# EAGLE design EcobitNRF9160 EV2 (EAGLE 9.2.2)
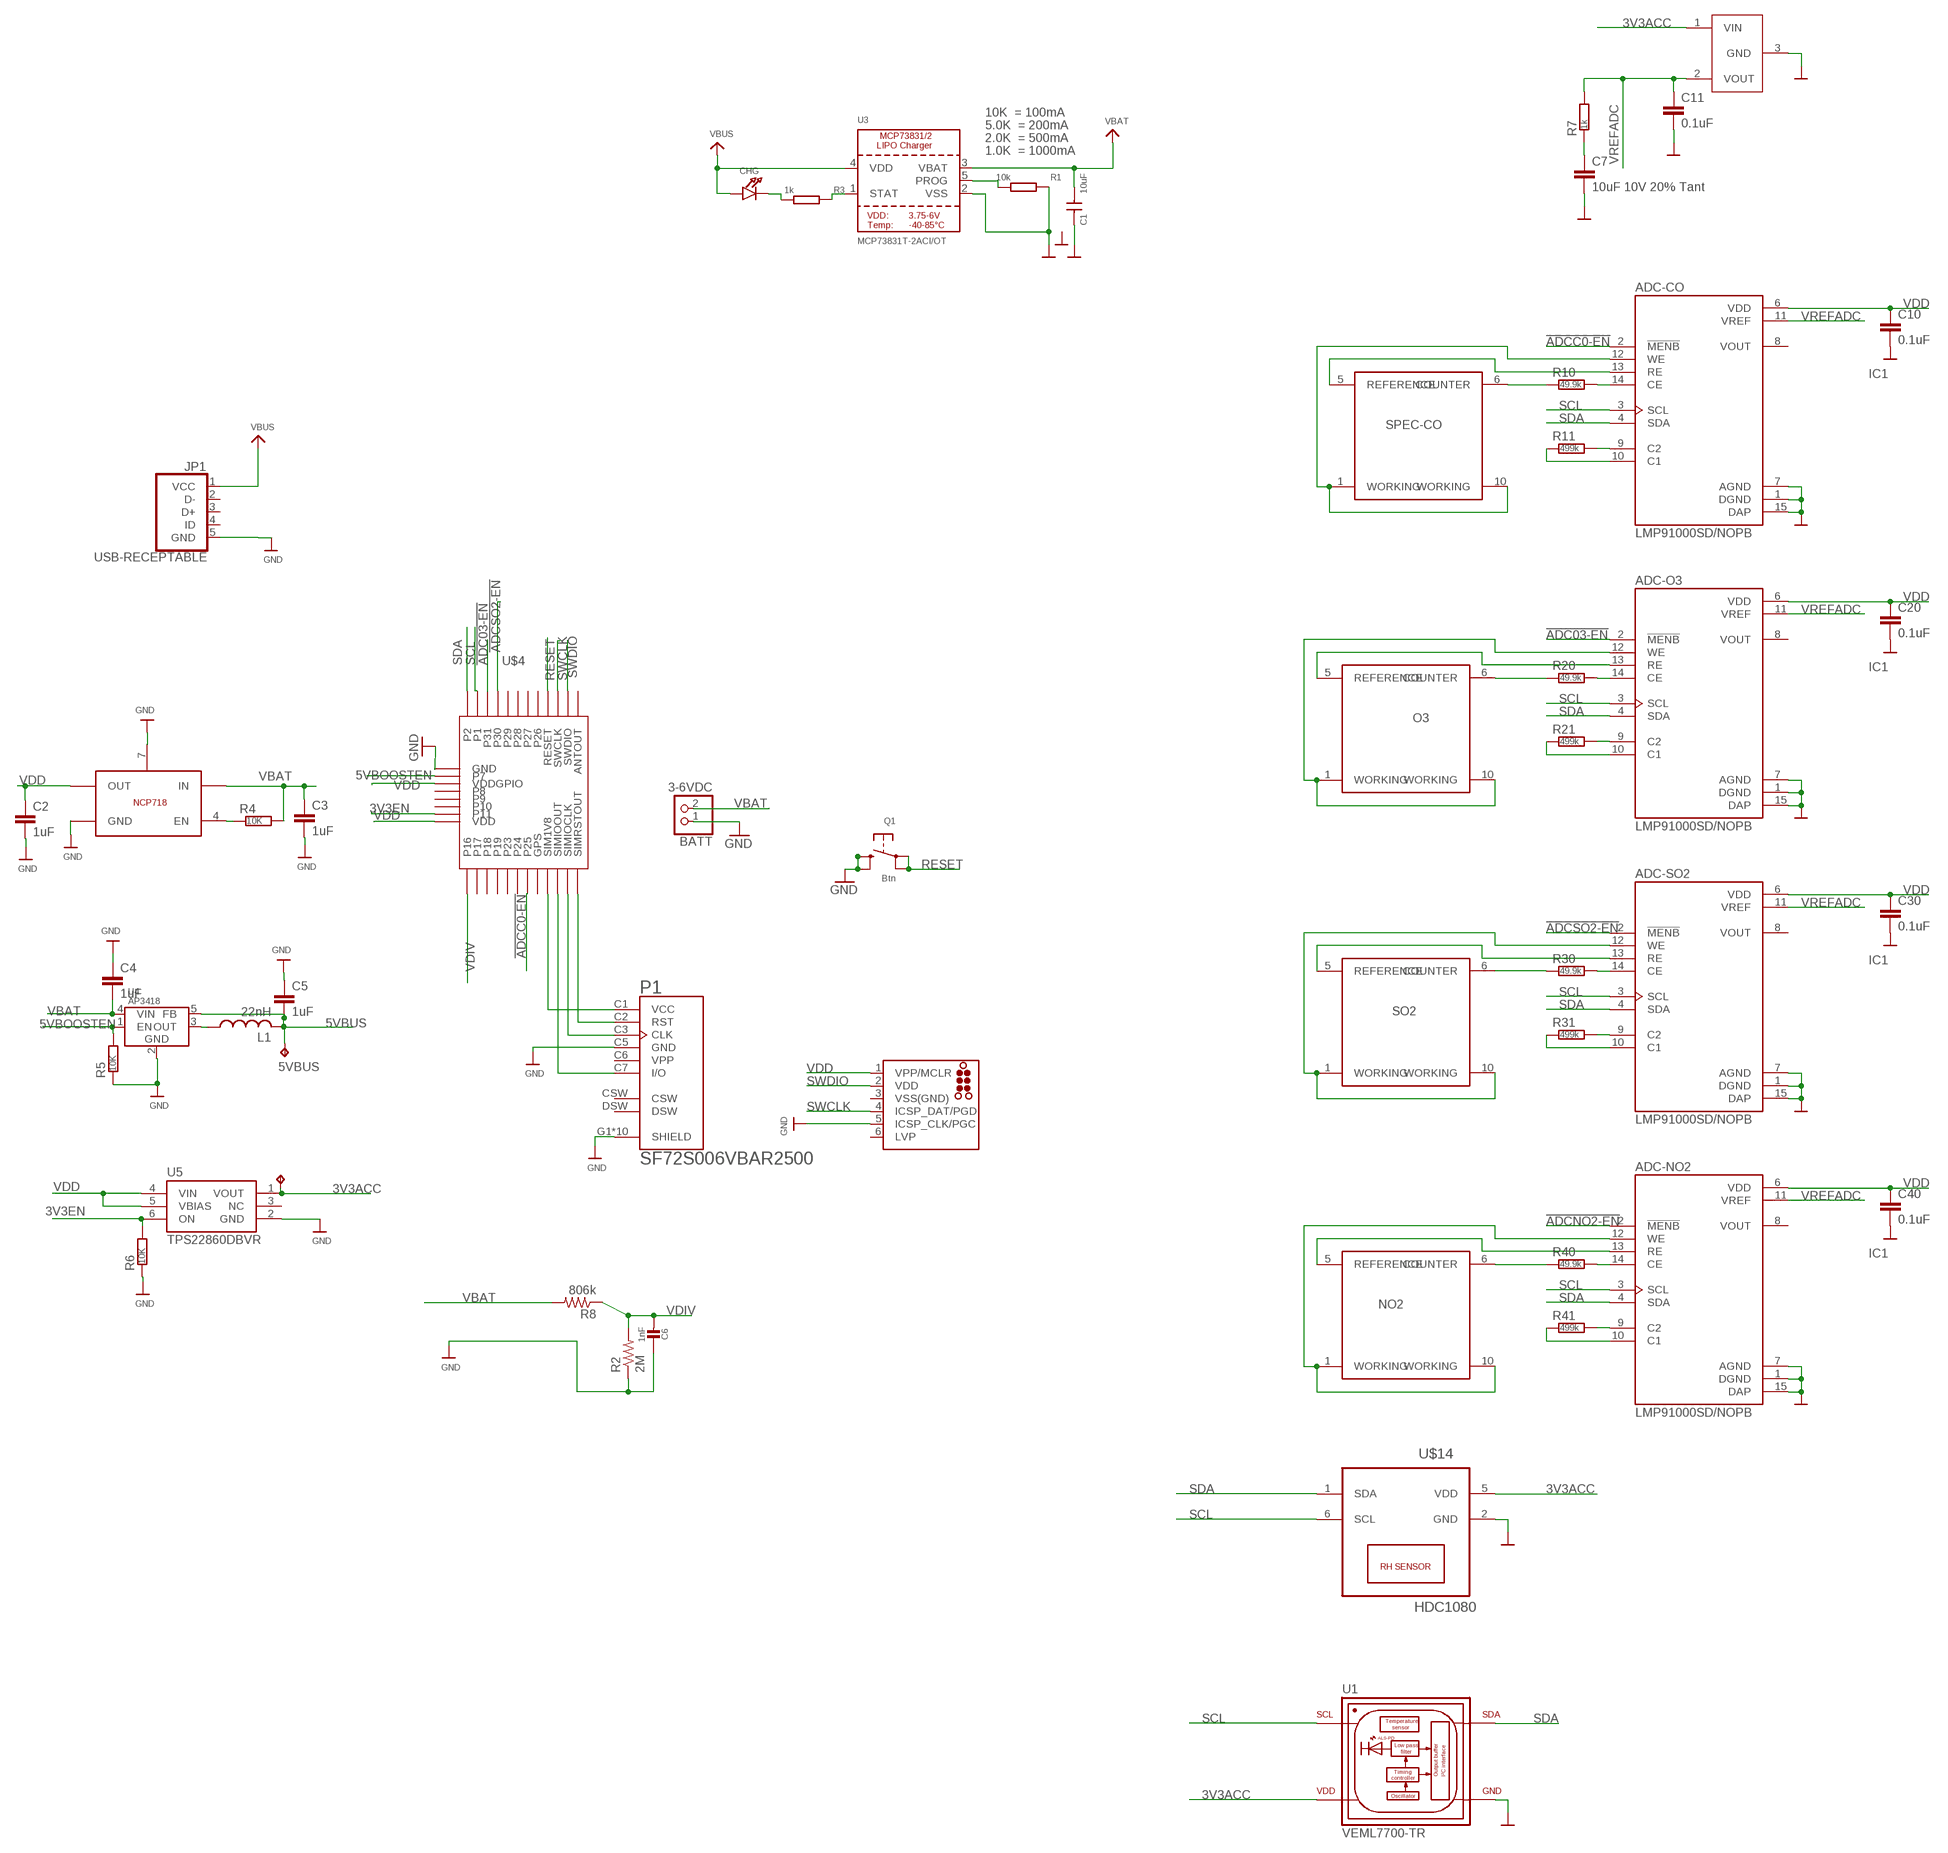
[diagram p0: schematic, sheet 1]

## Parts
5VBUS  TPTP15R  [TP15R]
5VBUS1  TPTP15R  [TP15R]
ADC-CO  LMP91000SD/NOPB  [SON50P400X400X80-15N]
ADC-NO2  LMP91000SD/NOPB  [SON50P400X400X80-15N]
ADC-O3  LMP91000SD/NOPB  [SON50P400X400X80-15N]
ADC-SO2  LMP91000SD/NOPB  [SON50P400X400X80-15N]
BATT  3-6VDC  CON_JST_PH_2PIN  [JSTPH2]
C1  10uF  CAP0402  [C-0402]
C2  1uF  CAPACITOR_0402_N  [RESC0402_N]
C3  1uF  CAPACITOR_0402_N  [RESC0402_N]
C4  1uF  CAPACITOR_0402_N  [RESC0402_N]
C5  1uF  CAPACITOR_0402_N  [RESC0402_N]
C6  1nF  CAP_CERAMIC0603_NO  [0603-NO]
C7  10uF 10V 20% Tant  CAPACITOR_0805_N  [RESC0805_N]
C10  0.1uF  CAPACITOR_0603_N  [RESC0603_N]
C11  0.1uF  CAPACITOR_0603_N  [RESC0603_N]
C20  0.1uF  CAPACITOR_0603_N  [RESC0603_N]
C30  0.1uF  CAPACITOR_0603_N  [RESC0603_N]
C40  0.1uF  CAPACITOR_0603_N  [RESC0603_N]
CHG  LED0805_NOOUTLINE  [CHIPLED_0805_NOOUTLINE]
IC1  ISL60002DIH320Z-TK  [SOT-23-3]
J2  TC2030-MCP-NL  [TC2030-MCP-NL]
JP1  USB-RECEPTABLE  [FCI-10103594-0001LF]
L1  22nH  INDUCTOR_0603_N  [RESC0603_N]
NO2  SPECSENSOR  [SPECSENSOR]
O3  SPECSENSOR  [SPECSENSOR]
P1  SF72S006VBAR2500  [JAE_SF72S006VBAR2500]
Q1  Btn  SWITCH_TACT_SMT4.6X2.8  [BTN_KMR2_4.6X2.8]
R1  10k  RESR0402  [R0402]
R2  2M  R-US_R0603  [R0603]
R3  1k  RESR0402  [R0402]
R4  10K  RESISTOR_0402_N  [RESC0402_N]
R5  10K  RESISTOR_0402_N  [RESC0402_N]
R6  10K  RESISTOR_0402_N  [RESC0402_N]
R7  1k  RESISTOR_0603_N  [RESC0603_N]
R8  806k  R-US_R0603  [R0603]
R10  49.9k  RESISTOR_0603_N  [RESC0603_N]
R11  499k  RESISTOR_0603_N  [RESC0603_N]
R20  49.9k  RESISTOR_0603_N  [RESC0603_N]
R21  499k  RESISTOR_0603_N  [RESC0603_N]
R30  49.9k  RESISTOR_0603_N  [RESC0603_N]
R31  499k  RESISTOR_0603_N  [RESC0603_N]
R40  49.9k  RESISTOR_0603_N  [RESC0603_N]
R41  499k  RESISTOR_0603_N  [RESC0603_N]
SO2  SPECSENSOR  [SPECSENSOR]
SPEC-CO  SPECSENSOR  [SPECSENSOR]
U1  VEML7700-TR  [XDCR_VEML7700-TR]
U2  NCP718  [NCP718-WDFN6]
U3  MCP73831T-2ACI/OT  MCP73831/2  [SOT23-5]
U4  AP3418  [SOT25]
U5  TPS22860DBVR  [R-PDSO-G6]
U$4  NRF9160MODULE  [NRF9160MODULE]
U$14  HDC1080  [TI-S-PWSON-N6]

## Nets
3V3ACC: 5VBUS1.TP IC1.1(VIN) U1.2(VDD) U5.1(VOUT) U$14.5(VDD)
3V3EN: R6.2 U5.6(ON) U$4.P11
5VBOOSTEN: R5.2 U4.1(EN) U$4.P7
5VBUS: 5VBUS.TP C5.2 L1.2 U4.5(FB)
!ADC03-EN: ADC-O3.2(!MENB) U$4.P31
!ADCC0-EN: ADC-CO.2(!MENB) U$4.P25
!ADCNO2-EN: ADC-NO2.2(!MENB)
!ADCSO2-EN: ADC-SO2.2(!MENB) U$4.P30
GND: ADC-CO.1(DGND) ADC-CO.7(AGND) ADC-CO.15(DAP) ADC-NO2.1(DGND) ADC-NO2.7(AGND) ADC-NO2.15(DAP) ADC-O3.1(DGND) ADC-O3.7(AGND) ADC-O3.15(DAP) ADC-SO2.1(DGND) ADC-SO2.7(AGND) ADC-SO2.15(DAP) BATT.1 C1.2 C2.2 C3.2 C4.1 C5.1 C6.1 C7.2 C10.2 C11.2 C20.2 C30.2 C40.2 IC1.3(GND) J2.5(ICSP_CLK/PGC) JP1.5(GND) P1.C5(GND) P1.G1(SHIELD) P1.G2(SHIELD) P1.G3(SHIELD) P1.G4(SHIELD) P1.G5(SHIELD) P1.G6(SHIELD) P1.G7(SHIELD) P1.G8(SHIELD) P1.G9(SHIELD) P1.G10(SHIELD) Q1.B'(S1) Q1.B(S) R1.1 R2.1 R5.1 R6.1 U1.3(GND) U2.3(GND) U2.7(GND) U3.2(VSS) U4.2(GND) U5.2(GND) U$4.GND U$14.2(GND)
N$1: P1.C1(VCC) U$4.SIM1V8
N$2: L1.1 U4.3(OUT)
N$3: R3.1 U3.1(STAT)
N$4: CHG.C R3.2
N$5: P1.C2(RST) U$4.SIMRSTOUT
N$6: P1.C3(CLK) U$4.SIMCLKOUT(SIMIOCLK)
N$7: P1.C7(I/O) U$4.SIMIOOUT
N$8: ADC-CO.9(C2) R11.2
N$9: ADC-CO.10(C1) R11.1
N$10: R1.2 U3.5(PROG)
N$11: ADC-CO.14(CE) R10.2
N$12: C7.1 R7.1
N$13: ADC-O3.9(C2) R21.2
N$14: ADC-O3.10(C1) R21.1
N$15: ADC-O3.14(CE) R20.2
N$16: ADC-SO2.9(C2) R31.2
N$17: ADC-SO2.10(C1) R31.1
N$18: ADC-SO2.14(CE) R30.2
N$19: ADC-NO2.9(C2) R41.2
N$20: ADC-NO2.10(C1) R41.1
N$21: ADC-NO2.14(CE) R40.2
R-EN: R4.1 U2.4(EN)
RESET: Q1.A'(P1) Q1.A(P) U$4.RESET
SCL: ADC-CO.3(SCL) ADC-NO2.3(SCL) ADC-O3.3(SCL) ADC-SO2.3(SCL) U1.1(SCL) U$4.P1 U$14.6(SCL)
SDA: ADC-CO.4(SDA) ADC-NO2.4(SDA) ADC-O3.4(SDA) ADC-SO2.4(SDA) U1.4(SDA) U$4.P2 U$14.1(SDA)
SPEC-CO-COUNTER: R10.1 SPEC-CO.6(COUNTER)
SPEC-CO-REF: ADC-CO.13(RE) SPEC-CO.5(REFERENCE)
SPEC-CO-WKG: ADC-CO.12(WE) SPEC-CO.1(WORKING) SPEC-CO.10(WORKING)
SPEC-NO2-COUNTER: NO2.6(COUNTER) R40.1
SPEC-NO2-REF: ADC-NO2.13(RE) NO2.5(REFERENCE)
SPEC-NO2-WKG: ADC-NO2.12(WE) NO2.1(WORKING) NO2.10(WORKING)
SPEC-O3-COUNTER: O3.6(COUNTER) R20.1
SPEC-O3-REF: ADC-O3.13(RE) O3.5(REFERENCE)
SPEC-O3-WKG: ADC-O3.12(WE) O3.1(WORKING) O3.10(WORKING)
SPEC-SO2-COUNTER: R30.1 SO2.6(COUNTER)
SPEC-SO2-REF: ADC-SO2.13(RE) SO2.5(REFERENCE)
SPEC-SO2-WKG: ADC-SO2.12(WE) SO2.1(WORKING) SO2.10(WORKING)
SWCLK: J2.4(ICSP_DAT/PGD) U$4.SWCLK
SWDIO: J2.2(VDD) U$4.SWDIO
VBAT: BATT.2 C1.1 C3.1 C4.2 R4.2 R8.2 U2.6(IN) U3.3(VBAT) U4.4(VIN)
VBUS: CHG.A JP1.1(VCC) U3.4(VDD)
VDD: ADC-CO.6(VDD) ADC-NO2.6(VDD) ADC-O3.6(VDD) ADC-SO2.6(VDD) C2.1 C10.1 C20.1 C30.1 C40.1 J2.1(VPP/MCLR) U2.1(OUT) U5.4(VIN) U5.5(VBIAS) U$4.VDD U$4.VDDGPIO
VDIV: C6.2 R2.2 R8.1 U$4.P16
VREFADC: ADC-CO.11(VREF) ADC-NO2.11(VREF) ADC-O3.11(VREF) ADC-SO2.11(VREF) C11.1 IC1.2(VOUT) R7.2
Unconnected: ADC-CO.8(VOUT) ADC-NO2.8(VOUT) ADC-O3.8(VOUT) ADC-SO2.8(VOUT) J2.6(LVP) JP1.2(D-) JP1.3(D+) JP1.4(ID) P1.CSW P1.DSW U5.3(NC) U$4.ANTOUT U$4.GPS U$4.P8 U$4.P9 U$4.P10 U$4.P17 U$4.P18 U$4.P19 U$4.P23 U$4.P24 U$4.P26 U$4.P27 U$4.P28 U$4.P29

## Notes on the sheet
- 10K  = 100mA
- 5.0K  = 200mA
- 2.0K  = 500mA
- 1.0K  = 1000mA

## Power pins joined to a net without a drawn wire
VPP: P1.C6(VPP)
VSS(GND): J2.3(VSS(GND))

## Library data of the parts
5VBUS 5VBUS1 = testpad:TP: Test pad
ADC-CO ADC-NO2 ADC-O3 ADC-SO2 = LMP91000SD_NOPB:LMP91000SD/NOPB: Configurable AFE Potentiostat for Low-Power Chemical Sensing Applications 14-WSON -40 to 85; AVAILABILITY: Unavailable; DESCRIPTION: Configurable AFE Potentiostat for Low-Power Chemical Sensing Applications 14-WSON -40 to 85; MF: Texas Instruments; MP: LMP91000SD/NOPB; PACKAGE: WFDFN-14 Texas Instruments; PRICE: None
BATT = microbuilder:CON_JST_PH_2PIN: JST 2-Pin Right-Angle Connector PH-Series - 4UConnector: 17311 SH-Series - 4UConnector: 07278
C1 = NANO2:CAP: CAP
C2-C5 C7 C10 C11 C20 C30 C40 = NordicMisc:CAPACITOR: Generic chip capacitor
C6 = microbuilder:CAP_CERAMIC: Ceramic Capacitors For new designs, use the packages preceded by an '_' character since they are more reliable: The following footprints should be used on most boards: _0402 - Standard footprint for regular board layouts _0603 - Standard footprint for regular board layouts _0805 - Standard footprint for regular board layouts _1206 - Standard footprint for regular board layouts For extremely tight-pitch boards where space is at a premium, the following 'micro-pitch' footprints can be used (smaller pads, no silkscreen outline, etc.): _0402MP - Micro-pitch footprint for very dense/compact boards _0603MP - Micro-pitch footprint for very dense/compact boards _0805MP - Micro-pitch footprint for very dense/compact boards _1206MP - Micro-pitch footprint for very dense/compact boards
CHG = microbuilder:LED: LED 0603 - 0603 Surface Mount Package 2mA: Green LED - Low Power (3.9mcd, 2ma, 1.7Vf) - Digikey: 475-2709-2-ND Orange LED - Low Power (9.8mcd, 2ma, 1.8Vf) - Digikey: 475-1194-2-ND Red LED - Low Power (5mcd, 2ma, 1.8Vf) - Digikey: 475-1195-2-ND Yellow LED - Low Power (7mcd, 2ma, 1.8Vf) - Digikey: 475-1196-2-ND 5mA: Blue LED - Low Power (17mcd, 5ma, 2.9Vf) - Digikey: LNJ937W8CRACT-ND 0805 - 0805 Surface Mount Package 2mA: Red LED (8.8mcd, 2mA, 1.8Vf, Clear) - Low Power [Digikey: 475-2510-1-ND] Green LED (5mcd, 2mA, 1.8Vf, Clear) - Low Power [Digikey: 475-2730-1-ND] Yellow LED (11.3mcd, 2mA, 1.8Vf, Clear) - Low Power [Digikey: 475-2555-1-ND] 20mA: Red LED (104mcd, 20mA, Diffused) - LS R976 [Digikey: 475-1278-6-ND] Red LED (12mcd, 20mA, 2.0Vf, Clear) - APT2012EC [Digikey: 754-1128-1-ND] Green LED (15mcd, 20mA, 2.2Vf, Clear) - APT2012GC [Digikey: 754-1131-1-ND] Orange LED (160mcd, 20mA, 2.1Vf, Clear) - APT2012SECK [Digikey: 754-1130-1-ND] 1206 - 1206 Surface Mount Package Green LED (26mcd, 20mA, Diffused) - LG N971 [Digikey: 475-1407-6-ND] Red LED (15mcd, 20mA, Diffused) - LH N974 [Digikey: 475-1416-6-ND] Cree - Cree High-Power Surface Mount LEDs XPEBWT-L1-0000-00D50 - White 111lm 350mA 2.9Vf 6200K 110° XTEAWT-00-0000-00000LEE3 - White 114lm 350mA 2.85Vf 5000K 115° Everlight - Everlight 45-21 Series Surface Mount LEDs 45-21/QK2C-B2832AC2CB2/2T - Warm White 2000mcd 20mA 3.25Vf 3050K 120° 45-21/LK2C-B38452C4CB2/2T - Nuetral White 2000mcd 20mA 3.25Vf 4150K 120° 45-21/LK2C-B50634C6CB2/2T - Cold White 2200mcd 20mA 3.25Vf 5650K 120° PLCC2 Reverse Mount LS T77K-J1L2-1-0-2-R18-Z - Red 11.25mcd 2mA 1.8Vf 630nm 120° LO T77K-L1M2-24-Z - Orange 19.6mcd 2mA 1.8Vf 606nm 120° LY T77K-K2M1-26-Z - Yellow 15.7mcd 2mA 1.8Vf 587nm 120°
IC1 = ISL60002DIH320Z-TK:ISL60002DIH320Z-TK
J2 = tag-connect:TC2030: TAG-CONNECT ICSP Connector Manufacturer: Tag-Connect <http://www.tag-connect.com> Cable for easy In-Circuit Serial Programming. Designed for Microchip ICD2, suitable for many others. Two variants - one "with legs" (for hands-free fit on PCB) and another "without legs" for quick programming. PAD Description 1 MCLR/Vpp 2 Vdd 3 GND 4 PGD (ISPDAT) 5 PGC (ISPCLK) 6 nc (used for LVP) ©2009 ROFA.cz - modified and updated by Robert Darlington ‹rdarlington@gmail.com›
JP1 = daspilker MICROUSB:USB-RECEPTABLE: USB Receptable
L1 = NordicMisc:INDUCTOR: Generic chip inductor
NO2 O3 SO2 SPEC-CO = SiliconSquared:SPECSENSOR
P1 = SF72S006VBAR2500:SF72S006VBAR2500: SF72 series, nano-SIM card connector, normail open type, 6 connector; AVAILABILITY: Unavailable; DESCRIPTION: SF72 series, nano-SIM card connector, normail open type, 6 connector; MF: JAE Electronics; MP: SF72S006VBAR2500; PACKAGE: None; PRICE: None
Q1 = microbuilder:SWITCH_TACT_SMT: SMT Tact Switches 6x6mm - Digikey: P12940SCT-ND KMR2 (4.6x2.8mm) - Digikey: 401-1426-1-ND EVQ-PQHB55 - Light Touch, 160GF (4.5x4.5mm) - Digikey: P8090SCT-ND KMT0 - KMT021 NGJ LHS (etc.) IP68/Waterproof - Digikey: CKN10289CT-ND
R1 R3 = 1RedBeard:RES: RES
R2 R8 = resistor:R-US_: RESISTOR, American symbol
R4-R7 R10 R11 R20 R21 R30 R31 R40 R41 = NordicMisc:RESISTOR: Generic chip resistor
U1 = VEML7700-TR:VEML7700-TR: Light to Digital Ambient Light Sensor Digital 0lux to 167000lux 8-Pin SMD T/R; DESCRIPTION: Light to Digital Ambient Light Sensor Digital 0lux to 167000lux 8-Pin SMD T/R; DIGI-KEY_PART_NUMBER: VEML7700CT-ND; DIGI-KEY_PURCHASE_URL: https://www.digikey.com/product-detail/en/vishay-semiconductor-opto-division/VEML7700-TR/VEML7700CT-ND/5820244?utm_source=snapeda&utm_medium=aggregator&utm_campaign=symbol; MF: Vishay; MP: VEML7700-TR; PACKAGE: SMD-4 Vishay
U2 = NCP718 Low Dropout Regulator:NCP718
U3 = microbuilder:MCP73831/2: MCP73831/2 LIPO Charger VDD: 3.75 - 6V Temp -40 - 85°C Programmable Charge Rate: 15-500mA NOTE: STAT is a tri-state logic output on the MCP73831 and an open-drain output on the MCP73832. SOT23-5 with 4.2V output and tri-state logic on STAT = MCP73831T-2ACI/OT
U4 = AP3418 3v3 to 5V DCDC Booster:AP3418
U5 = TexasCustom:TPS22860DBVR: Power Switch ICs - Power Distribution TPS22860 Ultra-low leakage load switch 6-SOT-23 -40 to 85
U$4 = switch-ck:NRF9160MODULE
U$14 = Texas HDC1080 Humidity-Temp sensor:HDC1080

## Board
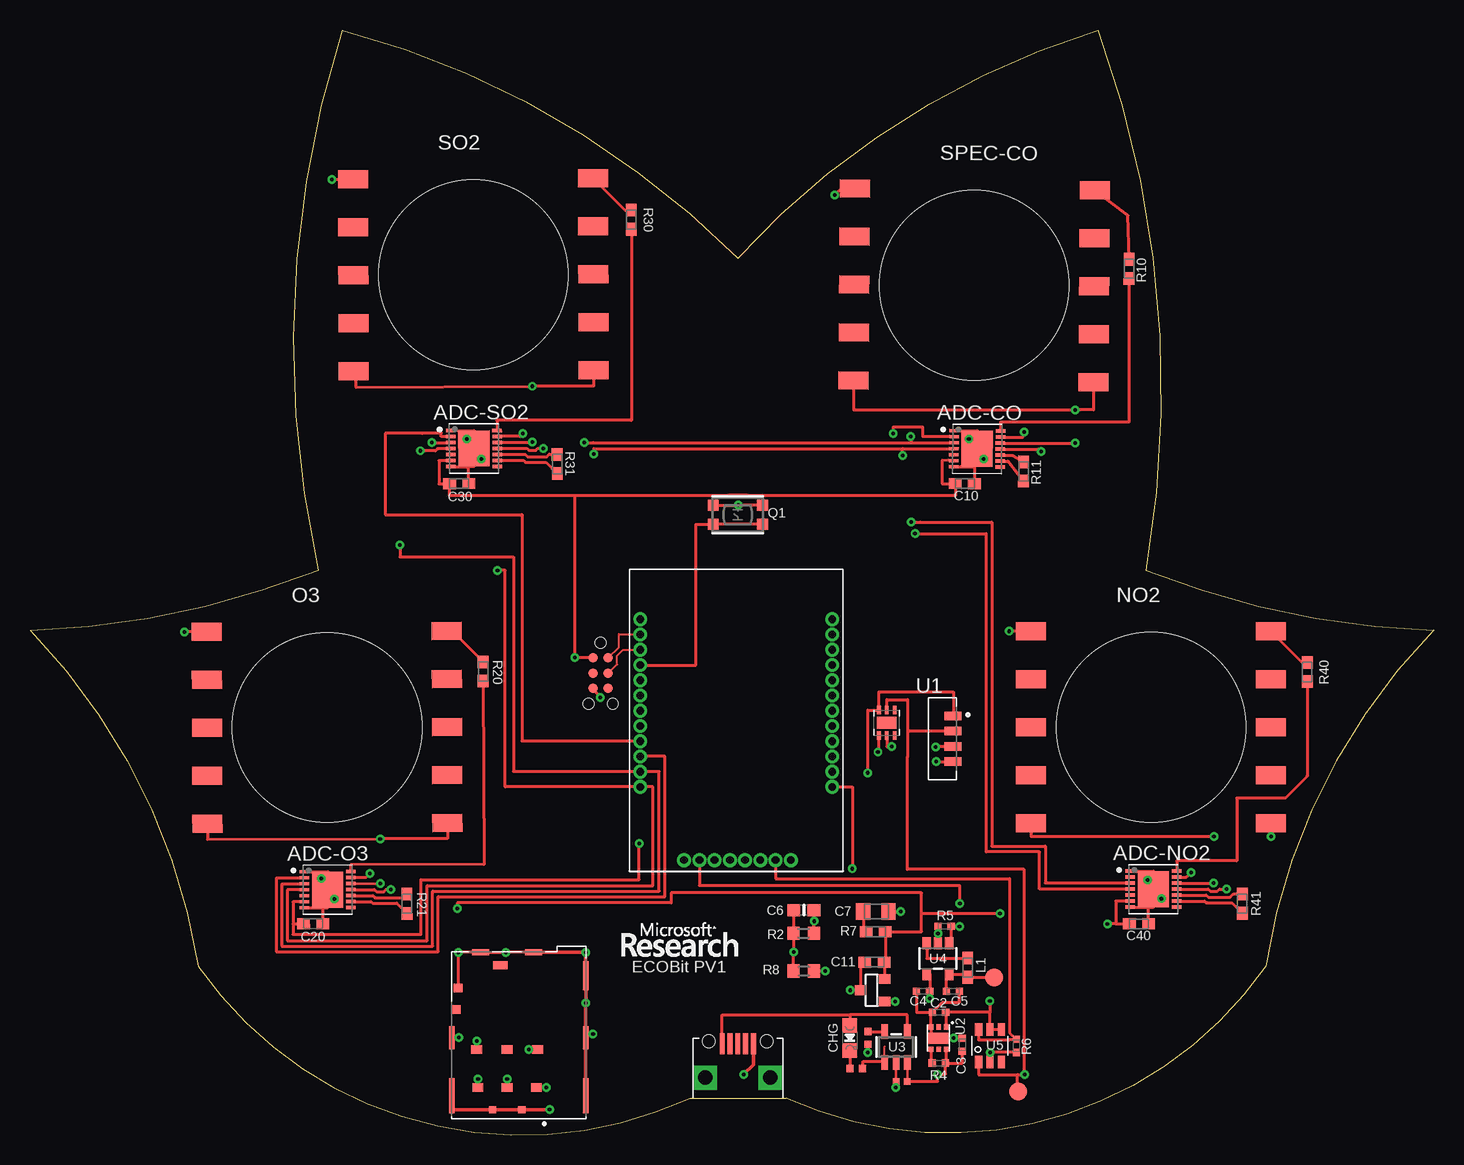
[diagram p1: board, top side]
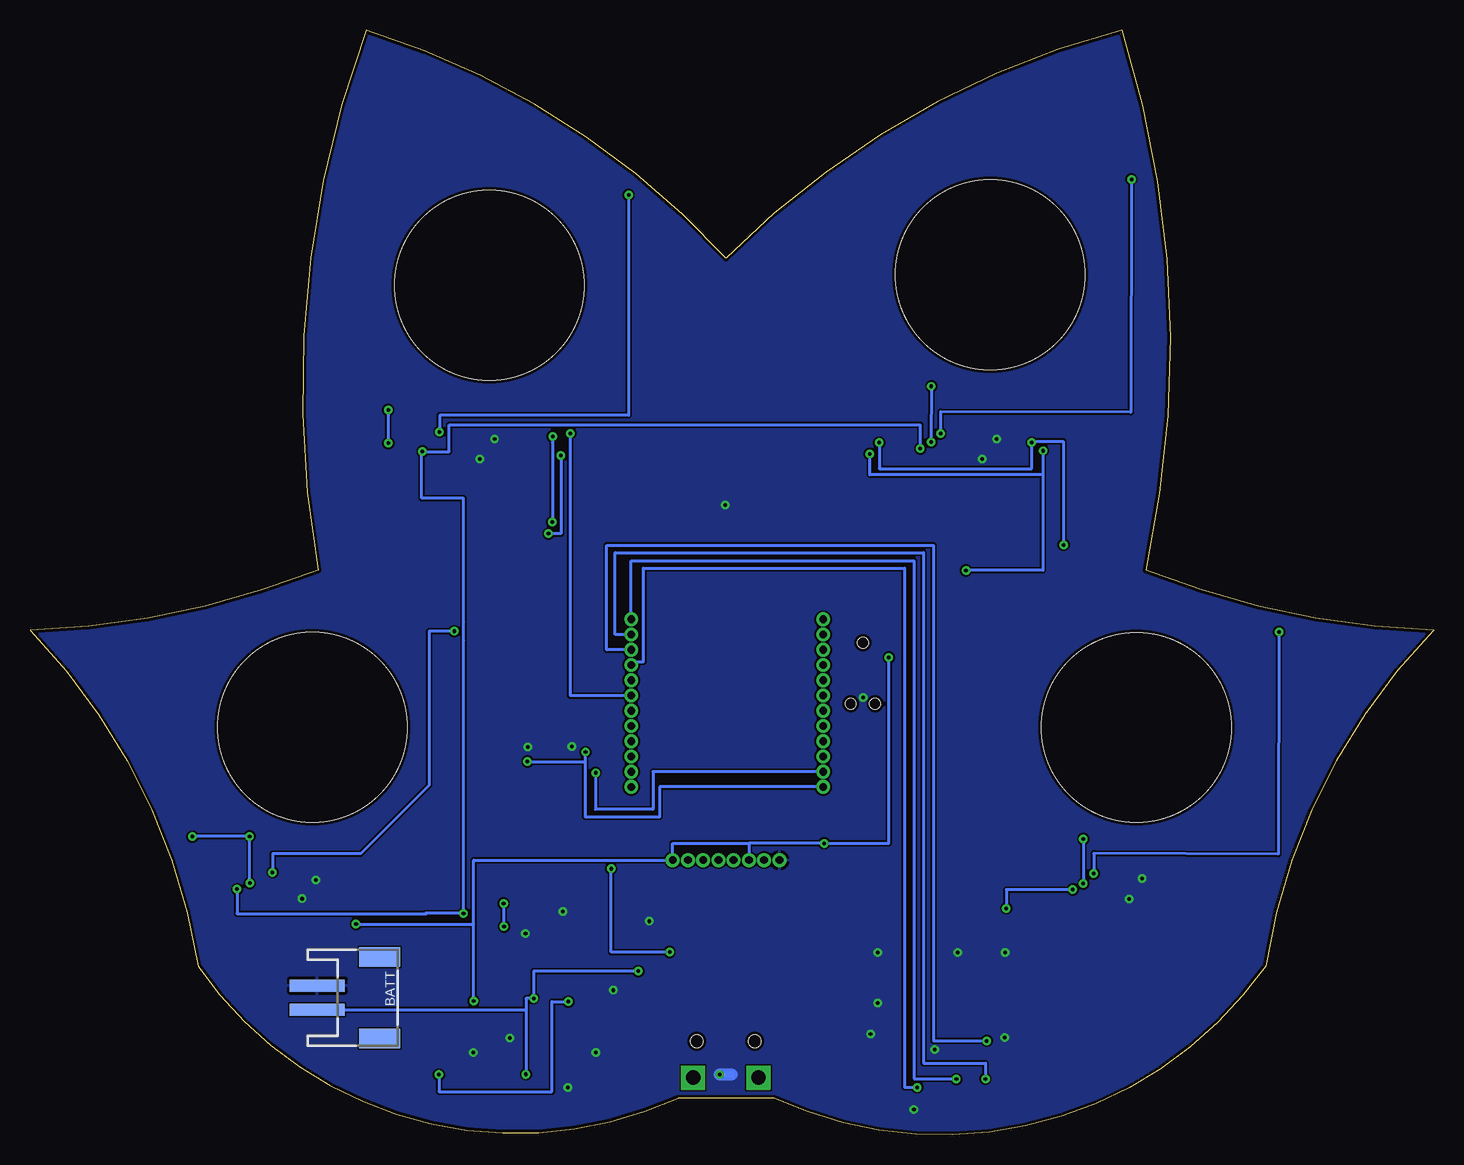
[diagram p2: board, bottom side, seen from below]

Size 117 x 92.07 mm. Coordinates in mm from the lower left corner, seen from the top.
Outline: 0,42.07 arc-35 14,14.07 arc80 55,3.07 63,3.07 arc80 103,14.07 arc-35 117,42.07 arc-20 93,47.07 arc30 89,92.07 arc30 59,73.07 arc30 26,92.07 arc30 24,47.07 arc-20 0,42.07
Copper layers (1*16): Top 0.035mm / dielectric 1.5mm / Bottom 0.035mm
Design rules "default *": minimum track width 6mil, minimum drill 0.3mm, track to track 6mil, track to pad 6mil, pad to pad 6mil, via to via 6mil, smd to smd 0mil, copper to edge 10mil, drill to drill 6mil, minimum pad ring 10mil, minimum via ring 8mil, stop-mask expansion 4mil, vias tented up to drill 0mil, thermal gap 10mil

### Footprints (pad centres in the part's own frame; a part is rotated, then mirrored left to right if it is on the bottom)
TP15R = smd 1.5 x 1.5: TP 0,0
SON50P400X400X80-15N = smd 0.86 x 0.27: 1 -1.935,1.5; 2 -1.935,1; 3 -1.935,0.5; 4 -1.935,0; 5 -1.935,-0.5; 6 -1.935,-1; 7 -1.935,-1.5; 8 1.935,-1.5; 9 1.935,-1; 10 1.935,-0.5; 11 1.935,0; 12 1.935,0.5; 13 1.935,1; 14 1.935,1.5 | smd 2.6 x 3: 15 0,0
JSTPH2 = smd 1 x 4.6: 1 -1,-3.7; 2 1,-3.7 | smd 1.6 x 3.4: NC1 -3.4,1.5; NC2 3.4,1.5
C-0402 = smd 0.55 x 0.55: 1 -0.47,0; 2 0.47,0
RESC0402_N = smd 0.6 x 0.6: 1 -0.55,0; 2 0.55,0
0603-NO = smd 1.075 x 1: 1 -0.85,0; 2 0.85,0
RESC0805_N = smd 1.2 x 1.35: 1 -1.1,0; 2 1,0
RESC0603_N = smd 1.05 x 0.9: 1 -0.8,0; 2 0.8,0
CHIPLED_0805_NOOUTLINE = smd 1.2 x 1.2: A 0,-1.05; C 0,1.05
SOT-23-3 = smd 0.802 x 0.972: 1 -0.95,-1; 2 0.95,-1; 3 0,1
TC2030-MCP-NL = smd 0.787 x 0.787: 1 1.27,-0.635; 2 1.27,0.635; 3 2.54,-0.635; 4 2.54,0.635; 5 3.81,-0.635; 6 3.81,0.635 | hole 0.889: 0,0; 5.08,-1.016; 5.08,1.016
FCI-10103594-0001LF = smd 0.4 x 1.75: 1 -1.3,4.525; 2 -0.65,4.525; 3 0,4.525; 4 0.65,4.525; 5 1.3,4.525 | drill 1.2 pad 2 square: P$3 -2.725,1.7; P$4 2.725,1.7 | hole 1.05: -2.425,4.73; 2.425,4.73
SPECSENSOR = smd 2.5 x 1.5: 1 -10,-8; 2 -10,-4; 3 -10,0; 4 -10,4; 5 -10,8; 6 10,8; 7 10,4; 8 10,0; 9 10,-4; 10 10,-8 | hole 15.8: 0,0
JAE_SF72S006VBAR2500 = smd 0.9 x 0.7: C1 2.44,-4.575; C2 0,-4.575; C3 -2.44,-4.575; C5 2.54,-1.405; C6 0,-1.405; C7 -2.54,-1.405 | smd 0.7 x 0.7: CSW -4.245,1.925 | smd 1.2 x 0.65: DSW -0.55,5.6 | smd 0.45 x 2.9: G1 -4.595,-5.275; G8 6.555,-5.275 | smd 0.45 x 1.9: G2 -4.595,-0.425; G7 6.555,-0.425 | smd 0.75 x 0.7: G3 -4.095,3.725 | smd 1.4 x 0.5: G4 -2.2,6.675; G5 2.2,6.675 | smd 0.45 x 2.4: G6 6.555,4.725 | smd 0.6 x 0.6: G9 1.22,-6.425; G10 -1.22,-6.425
BTN_KMR2_4.6X2.8 = smd 0.9 x 0.9: A 2.05,0.8; A' -2.05,0.8; B 2.05,-0.8; B' -2.05,-0.8
R0402 = smd 0.6 x 0.6: 1 -0.525,0; 2 0.525,0
R0603 = smd 1 x 1.1: 1 -0.85,0; 2 0.85,0
XDCR_VEML7700-TR = smd 1.4 x 0.7: 1 0.55,1.905; 2 0.55,0.635; 3 0.55,-0.635; 4 0.55,-1.905
NCP718-WDFN6 = smd 0.4 x 0.45: 1 0.65,0.925; 2 0,0.925; 3 -0.65,0.925; 4 -0.65,-0.925; 5 0,-0.925; 6 0.65,-0.925 | smd 1.72 x 0.9: 7 0,0
SOT23-5 = smd 0.55 x 1.2: 1 -0.95,-1.3; 2 0,-1.3; 3 0.95,-1.3; 4 0.95,1.3; 5 -0.95,1.3
SOT25 = smd 1 x 0.7: 1 -1.3,0.95; 2 -1.3,0; 3 -1.3,-0.95; 4 1.3,-0.95; 5 1.3,0.95
R-PDSO-G6 = smd 0.6 x 1.05: 1 -0.95,-1.35; 2 0,-1.35; 3 0.95,-1.35; 4 0.95,1.35; 5 0,1.35; 6 -0.95,1.35
NRF9160MODULE = drill 0.65: ANTOUT 20.985,16.9; GND 0.92,13.245; GPS 15.905,0.9; P1 8.285,16.9; P2 7.015,16.9; P7 0.92,11.975; P8 0.92,9.435; P9 0.92,8.165; P10 0.92,6.895; P11 0.92,5.625; P16 7.015,0.9; P17 8.285,0.9; P18 9.555,0.9; P19 10.825,0.9; P23 12.095,0.9; P24 13.365,0.9; P25 14.635,0.9; P26 15.905,16.9; P27 14.635,16.9; P28 13.365,16.9; P29 12.095,16.9; P30 10.825,16.9; P31 9.555,16.9; RESET 17.175,16.9; SIM1V8 17.175,0.9; SIMCLKOUT 19.715,0.9; SIMIOOUT 18.445,0.9; SIMRSTOUT 20.985,0.9; SWCLK 18.445,16.9; SWDIO 19.715,16.9; VDD 0.92,4.355; VDDGPIO 0.92,10.705
TI-S-PWSON-N6 = smd 0.3 x 0.7: 1 -0.65,-1.05; 2 0,-1.05; 3 0.65,-1.05; 4 0.65,1.05; 5 0,1.05; 6 -0.65,1.05 | smd 1.6 x 1: 7 0,0

### Placement (x,y rotation side)
5VBUS  80.39,13.12 0 top
5VBUS1  82.36,3.61 0 top
ADC-CO  78.96,57.17 359.6 top
ADC-NO2  93.65,20.48 0 top
ADC-O3  24.81,20.43 0.2 top
ADC-SO2  37.01,57.2 0.2 top
BATT  89.35,11.43 270 bottom
C1  72.67,4.46 180 top
C2  75.78,10.22 180 top
C3  77.72,7.51 90 top
C4  74.45,11.98 0 top
C5  76.94,11.96 180 top
C6  64.51,18.73 180 top
C7  70.56,18.61 0 top
C10  77.93,54.27 359.6 top
C11  70.4,14.39 180 top
C20  23.61,17.6 0.2 top
C30  35.78,54.28 0.2 top
C40  92.45,17.59 0 top
CHG  68.35,8.08 180 top
IC1  70.25,12.06 90 top
J2  47.57,41.02 270 top
JP1  59,3.07 0 top
L1  78.17,13.94 270 top
NO2  93.45,33.97 0 top
O3  24.76,33.96 0.2 top
P1  39.77,8.53 0 top
Q1  59,51.68 180 top
R1  69.86,8.09 90 top
R2  64.49,16.79 180 top
R3  68.87,5.53 180 top
R4  75.76,5.99 0 top
R5  76.25,17.39 0 top
R6  82.22,7.41 90 top
R7  70.5,16.93 0 top
R8  64.51,13.66 0 top
R10  91.62,72.17 269.6 top
R11  82.83,55.29 269.6 top
R20  37.78,38.62 270.2 top
R21  31.42,19.27 270.2 top
R30  50.13,76.27 270.2 top
R31  43.95,55.91 270.2 top
R40  106.47,38.58 270 top
R41  101.06,19.27 270 top
SO2  36.96,71.68 0.2 top
SPEC-CO  78.7,70.8 359.6 top
U1  76.38,33.01 0 top
U2  75.75,8.06 0 top
U3  72.19,7.32 0 top
U4  75.69,14.69 270 top
U5  80.03,7.42 0 top
U$4  67.78,21.98 90 top
U$14  71.42,34.35 0 top

### Tracks (layer width: path | path; a pad name or v marks a point on that pad's centre or on a via)
3V3ACC  (via drill 0.3)
  Top 0.254: U5.1 79.08,5.03 82.32,5.03 82.32,5.02 | 5VBUS1.TP 82.32,3.61 82.32,5.02 | 82.32,5.02 v82.92,5.02 82.86,5.08 82.86,22.12 73.14,22.12 73.14,31.5 73.15,31.5 73.15,33.63 73.15,33.65 | IC1.1 v72.12,11.11 | U$14.5 71.42,36.28 73.15,36.28 73.15,33.65 | U1.2 73.15,33.65
  Bottom 0.254: v82.92,5.02 82.92,3.6 73.48,3.6 73.48,11.11 v72.12,11.11
3V3EN
  Top 0.254: U5.6 79.08,7.91 81.61,7.91 81.61,7.96 R6.2 81.65,8.53 81.65,21.35 62.15,21.35 U$4.P11
5VBOOSTEN  (via drill 0.3)
  Top 0.254: U4.1 76.8,15.99 R5.2 | 76.83,17.39 R5.2 | R5.2 77.48,17.39 v77.48,17.37 | U$4.P7 55.8,20.8 77.5,20.8 77.5,19.29 v77.52,19.29
  Bottom 0.254: v77.52,19.29 77.52,17.37 v77.48,17.37
5VBUS
  Top 0.254: C5.2 76.39,13.39 U4.5 78.17,13.39 L1.2 78.17,13.12 5VBUS.TP
!ADC03-EN
  Top 0.254: ADC-O3.2 22.87,21.4 20.53,21.4 20.53,15.27 34.03,15.27 34.03,19.85 52.92,19.85 52.92,31.54 U$4.P31
!ADCC0-EN  (via drill 0.3)
  Top 0.254: ADC-CO.2 74.42,58.18 74.42,58.99 71.95,58.99 v71.95,58.46
  Bottom 0.254: U$4.P25 71.96,36.62 71.96,58.45 v71.95,58.46
!ADCSO2-EN
  Top 0.254: ADC-SO2.2 34.28,58.19 34.28,58.47 32.7,58.47 29.62,58.47 29.62,51.68 41,51.68 41,32.81 U$4.P30
GND  (via drill 0.3)
  Top 0.152: C1.2 72.2,3.95 v72.17,3.95
  Top 0.203: U3.2 C1.2
  Top 0.254: v72.19,3.95 v72.17,3.95 | R1.1 69.86,6.86 v69.84,6.86 | C2.2 75.1,10.08 U2.3 75.1,8.06 U2.7 v77.01,8.06 | C3.2 v77.01,8.06 | v77.01,8.06 | R5.1 v75.69,16.78 | U4.2 v75.69,16.78 | v75.69,16.78 | C4.1 73.9,10.22 C2.2 | C2.2 76.07,11.05 77.5,11.05 77.49,11.06 C5.1 | U5.2 v80.03,6.86 | v80.03,6.86 | v80.03,6.86 80.34,6.86 80.34,6.92 82.22,6.92 R6.1 | 46.33,8.37 46.29,8.42 v46.93,8.42 | Q1.B 59,52.48 | 59,52.48 v59.03,52.5 | Q1.B' 59,52.48 | P1.C5 42.29,7.11 v41.57,7.11 | v39.65,15.21 P1.G4 v35.7,15.21 v35.7,15.2 35.7,12.26 P1.G3 | v39.65,15.21 v39.65,15.2 | P1.G5 v39.65,15.21 | ADC-CO.7 77.6,55.68 78.75,55.65 | 78.75,55.65 C10.2 | C11.2 69.25,14.39 IC1.3 v68.37,12.05 | C7.2 v72.57,18.61 | ADC-O3.7 24.42,18.93 | 24.42,18.93 24.82,18.93 ADC-O3.15 | C20.2 24.43,17.6 24.42,18.93 | ADC-O3.1 24.83,21.93 24.83,20.43 ADC-O3.15 | ADC-SO2.7 36.58,55.7 | 36.58,55.7 37.01,55.7 ADC-SO2.15 | ADC-SO2.1 37,58.7 ADC-SO2.15 | C30.2 36.58,55.7 | ADC-NO2.7 93.25,18.98 | 93.25,18.98 93.65,18.98 ADC-NO2.15 | ADC-NO2.1 93.65,21.98 ADC-NO2.15 | C40.2 93.25,18.98 | ADC-CO.1 78.96,58.68 ADC-CO.15 | J2.5 v47.55,36.44 | U$14.2 71.42,32.35 v71.85,32.35 | ADC-CO.15 79.51,56.61 v79.51,56.33 | ADC-CO.15 78.96,55.86 78.75,55.65 | ADC-O3.15 24.81,20.83 v24.28,21.36 | ADC-SO2.15 37.01,56.92 v37.61,56.32 | ADC-NO2.15 92.48,21.65 92.48,21.93 v93.18,21.23 | U1.3 76.93,32.34 v75.5,32.34 | C6.1 v65.37,17.81 65.37,16.79 R2.1
  Top 0.305: P1.G8 P1.G7 46.33,8.37 46.33,10.99 v46.34,10.99 P1.G6 v46.33,15.21 | P1.C5 | v46.33,15.21 | v46.33,15.21 P1.G5 41.96,15.19 | v43.32,2.11 P1.G9 P1.G10 35.18,2.11 P1.G1 | v35.76,8.12 35.75,8.11 P1.G2 | JP1.5 60.3,5.85 v59.49,5.03
  Bottom 1.016: v59.49,5.03 58.51,5.03
  other vias: 78.27,58 25.37,19.66 36.4,57.99 94.31,19.68
  pour Bottom: 118.24,93.06 118.24,-1.28 -7.26,-1.28 -7.26,3.48 -7.25,3.48 -7.25,92.85
N$1  (via drill 0.3)
  Top 0.254: v43.04,3.96 P1.C1
  Bottom 0.254: U$4.SIM1V8 66.88,39.41 65.86,39.41 65.86,47.23 44.1,47.23 44.1,3.96 v43.04,3.96
N$2
  Top 0.254: U4.3 74.76,15.99 74.76,14.72 78.17,14.72 L1.1
N$3
  Top 0.152: U3.1 71.24,7.35 | 69.47,5.6 R3.1
  Top 0.254: R3.1 69.45,5.53 69.45,6.12 71.24,6.12 U3.1
N$4
  Top 0.152: R3.2
  Top 0.254: CHG.C R3.2
N$5  (via drill 0.3)
  Top 0.254: P1.C2 v39.77,4.64
  Bottom 0.254: U$4.SIMRSTOUT 66.88,47.83 43.31,47.83 43.31,4.69 39.82,4.69 v39.77,4.64
N$6  (via drill 0.3)
  Top 0.152: 37.31,3.96 P1.C3
  Top 0.254: v37.35,4.67 37.33,4.67 P1.C3
  Bottom 0.254: U$4.SIMCLKOUT 68.22,41.7 68.22,48.53 42.51,48.53 42.51,5.97 37.35,5.97 v37.35,4.67
N$7  (via drill 0.3)
  Top 0.152: 37.24,7.13 P1.C7
  Top 0.254: v37.24,7.84 37.24,7.13
  Bottom 0.254: U$4.SIMIOOUT 68.92,40.43 68.92,49.13 41.69,49.13 41.69,7.84 v37.24,7.84
N$8
  Top 0.254: ADC-CO.9 81.51,56.14 82.78,54.5 R11.2
N$9
  Top 0.254: ADC-CO.10 81.89,56.64 R11.1
N$10
  Top 0.254: R1.2 71.24,8.61 U3.5
N$11
  Top 0.254: R10.2 91.61,59.4 80.9,59.4 ADC-CO.14
N$12
  Top 0.254: C7.1 69.46,16.93 R7.1
N$13
  Top 0.254: ADC-O3.9 28.42,19.45 28.57,19.3 30.58,19.31 R21.2
N$14
  Top 0.254: ADC-O3.10 28.57,19.95 28.76,19.76 31.12,19.77 R21.1
N$15
  Top 0.254: R20.2 37.83,22.55 26.74,22.51 ADC-O3.14
N$16
  Top 0.254: ADC-SO2.9 41.12,56.21 41.3,56.05 43.01,56.05 R31.2
N$17
  Top 0.254: R31.1 43.93,56.72 43.28,56.72 43.07,56.51 41.48,56.51 41.27,56.71 ADC-SO2.10
N$18
  Top 0.254: ADC-SO2.14 38.93,59.55 50.13,59.55 R30.2
N$19
  Top 0.254: ADC-NO2.9 97.91,19.48 98.06,19.34 100.19,19.34 R41.2
N$20
  Top 0.254: ADC-NO2.10 98.06,19.98 98.25,19.79 100.03,19.79 100.32,20.09 101.04,20.09 R41.1
N$21
  Top 0.254: ADC-NO2.14 | R40.2 106.47,29.93 106.52,29.93 104.66,28.07 100.59,28.07 100.59,22.84 95.58,22.84 ADC-NO2.14
R-EN
  Top 0.254: U2.4 75.1,6.1 R4.1
RESET
  Top 0.254: Q1.A' Q1.A 55.52,50.88 55.52,39.16 U$4.RESET
  Bottom 0.152: 50.84,39.2 U$4.RESET
SCL  (via drill 0.3)
  Top 0.254: ADC-O3.3 22.87,20.9 20.99,20.9 20.99,15.73 33.57,15.73 33.57,20.31 52.44,20.31 52.44,30.28 50.88,30.28 U$4.P1 50.87,30.28 40.31,30.28 40.31,48.16 30.84,48.16 | 73.43,57.68 46.95,57.68 v46.2,57.68 | 73.43,57.68 ADC-CO.3 | v33.49,57.69 ADC-SO2.3 | ADC-NO2.3 84.64,20.98 84.64,24.07 | 84.64,24.07 84.64,24.08 | 84.64,24.07 80.18,24.07 80.18,51.06 74.22,51.06 v73.46,51.06 | v73.43,58.2 73.43,57.68 | v30.84,49.17 30.84,48.16 | 30.84,48.16 30.82,48.16 | v69.84,30.18 69.84,35.4 U$14.6 70.77,36.92 76.96,36.92 76.96,34.92 U1.1
  Bottom 0.254: v46.2,57.68 46.2,55.51 33.49,55.51 v33.49,57.69 33.34,57.69 33.34,57.8 30.87,57.8 30.87,49.17 v30.84,49.17 | v73.46,51.06 73.46,57.68 73.45,57.68 73.45,58.17 v73.43,58.2 | U$4.P1 65.08,30.27 65.08,27.12 69.87,27.12 69.87,30.15 v69.84,30.18
SDA  (via drill 0.3)
  Top 0.254: ADC-O3.4 21.45,20.43 21.45,16.19 33.11,16.19 33.11,20.77 51.92,20.77 51.92,29 U$4.P2 39.62,29 39.62,47.04 v38.98,47.04 | ADC-SO2.4 33.96,57.19 33.77,57 32.56,57 v32.55,57.01 | v47,56.75 v46.99,56.75 46.99,57.18 72.75,57.18 | 72.75,57.18 ADC-CO.4 | ADC-NO2.4 84.16,20.48 84.16,23.59 79.72,23.59 79.72,50.11 v73.77,50.11 | v72.75,56.62 72.75,57.18 | v70.69,31.9 70.77,31.9 U$14.1 | v75.53,31.11 U1.4
  Bottom 0.254: v47,56.75 47,55.01 32.55,55.01 v32.55,57.01 32.55,47.04 v38.98,47.04 | v73.77,50.11 72.74,50.11 v72.74,56.62 v72.75,56.62 | U$4.P2 64.51,29 64.51,26.5 70.72,26.5 70.72,31.07 70.72,31.11 | v70.69,31.9 70.72,31.9 70.72,31.11 | v75.53,31.11 70.72,31.11
SPEC-CO-COUNTER
  Top 0.254: R10.1 91.52,76.63 SPEC-CO.6
SPEC-CO-REF  (via drill 0.3)
  Top 0.254: ADC-CO.13 82.74,58.13 v82.87,58.58 | SPEC-CO.5 67.63,78.87 v67.09,78.33
  Bottom 0.254: v67.09,78.33 67.09,59.97 82.85,59.97 82.85,58.58 v82.87,58.58
SPEC-CO-WKG  (via drill 0.3)
  Top 0.254: SPEC-CO.1 68.65,60.41 v87.14,60.41 88.65,60.41 SPEC-CO.10 | ADC-CO.12 87.12,57.66 v87.12,57.65
  Bottom 0.254: v87.14,60.41 87.14,57.65 v87.12,57.65
SPEC-NO2-COUNTER
  Top 0.254: NO2.6 106.04,39.38 R40.1
SPEC-NO2-REF  (via drill 0.3)
  Top 0.254: ADC-NO2.13 96.39,21.48 v96.78,21.88 | NO2.5 v81.64,41.97
  Bottom 0.254: v81.64,41.97 83.73,41.97 83.73,29.14 89.42,23.44 96.75,23.44 96.75,21.88 v96.78,21.88
SPEC-NO2-WKG  (via drill 0.3)
  Top 0.254: ADC-NO2.12 v98.68,20.98 | NO2.1 83.45,24.88 v98.69,24.88 | NO2.10 v103.46,24.86
  Bottom 0.254: v98.68,20.98 v98.68,24.88 v98.69,24.88 103.46,24.88 v103.46,24.86
SPEC-O3-COUNTER
  Top 0.254: O3.6 35.18,41.99 R20.1
SPEC-O3-REF  (via drill 0.3)
  Top 0.254: v28.33,21.79 27.99,21.45 ADC-O3.13 | O3.5 v12.88,41.92 v12.88,41.91
  Bottom 0.254: v12.88,41.91 12.94,23.4 28.32,23.46 | 28.33,23.46 28.32,23.46 | 28.32,23.46 v28.33,21.79
SPEC-O3-WKG  (via drill 0.3)
  Top 0.254: O3.1 14.8,24.62 29.21,24.67 | O3.10 34.81,25.99 34.81,24.69 29.21,24.67 | ADC-O3.12 29.18,20.95 v29.2,20.93 | 29.21,24.67 v29.19,24.65
  Bottom 0.254: v29.19,24.65 v29.2,20.93
SPEC-SO2-COUNTER
  Top 0.254: SO2.6 49.59,77.07 R30.1
SPEC-SO2-REF  (via drill 0.3)
  Top 0.254: ADC-SO2.13 40.85,58.21 v41.09,58.45 | v25.18,79.62 26.91,79.63 SO2.5
  Bottom 0.254: v25.18,79.62 25.25,60.21 41.08,60.26 41.09,60.25 v41.09,58.45
SPEC-SO2-WKG  (via drill 0.3)
  Top 0.254: SO2.1 27.16,63.65 27.16,62.32 41.87,62.37 | SO2.10 46.99,62.39 41.87,62.37 | ADC-SO2.12 v41.87,57.72 v41.87,57.73 | 41.87,62.37 v41.86,62.39
  Bottom 0.254: v41.86,62.39 v41.88,57.73 v41.87,57.73
SWCLK
  Top 0.152: J2.4 48.94,39.22 48.94,39.93 49.43,40.43 U$4.SWCLK
SWDIO
  Top 0.152: J2.2 49.09,40.63 49.09,41.72 50.85,41.72 U$4.SWDIO
VBAT  (via drill 0.3)
  Top 0.203: U3.3 C1.1
  Top 0.254: U3.3 73.16,6 | 73.14,4.44 C1.1 | R4.2 76.4,6.07 U2.6 | R4.2 77.72,5.99 C3.1 | 76.31,5.08 | 76.31,5.08 R4.2 | C1.1 75.66,4.45 v75.66,5.05 76.31,5.05 76.31,5.08 | U4.4 75,13.39 C4.2 v75,11.38 v75.01,11.38 | v66.3,13.65 R8.2
  Bottom 0.254: BATT.2 75.66,10.43 | 75.66,10.43 v75.66,5.05 | 75.66,10.43 75.66,11.38 v75.01,11.38 75.01,13.65 v66.3,13.65
VBUS
  Top 0.254: 73.17,8.65 U3.4 73.14,10 68.35,10 | 68.35,10 CHG.A | JP1.1 57.7,10 68.35,10
VDD  (via drill 0.3)
  Top 0.254: U2.1 76.4,10.15 C2.1 80.02,10.22 | U5.4 U5.5 80.03,10.22 80.02,10.22 | v80.02,11.16 80.02,10.22 | ADC-CO.6 76.03,56.2 76.03,54.28 C10.1 77.13,53.26 59.81,53.26 59.81,53.29 58.24,53.29 58.24,53.26 45.43,53.26 | ADC-O3.6 21.92,19.42 21.93,17.59 | 21.93,17.59 C20.1 | ADC-SO2.6 34.09,56.19 34.09,54.25 34.98,54.26 C30.1 34.98,53.26 45.43,53.26 | ADC-NO2.6 90.5,19.48 90.5,17.59 | 90.5,17.59 C40.1 | 21.93,17.59 21.93,16.7 27.09,16.7 27.1,16.69 32.6,16.69 32.6,21.27 50.79,21.27 v50.79,24.29 | J2.1 45.44,39.75 v45.41,39.78 45.43,39.78 45.43,53.26 | 90.5,17.59 89.81,17.59 v89.81,17.57
  Bottom 0.152: v50.79,24.29
  Bottom 0.254: 57.08,24.29 63.42,24.29 U$4.VDD 80.02,22.9 80.02,17.57 | 57.08,24.29 U$4.VDDGPIO | v50.79,24.29 57.08,24.29 | v80.02,11.16 80.02,17.57 | v89.81,17.57 80.02,17.57 | v50.79,24.29 45.41,24.29 v45.41,39.78
VDIV  (via drill 0.3)
  Top 0.254: C6.2 63.66,16.79 R2.2 63.64,15.24 v63.66,15.24 | v63.66,15.24 v63.67,15.24 | R8.1 v63.66,15.24 | U$4.P16 68.55,29 v68.55,22.18
  Bottom 0.254: v63.67,15.24 68.55,15.24 v68.55,22.18
VREFADC  (via drill 0.3)
  Top 0.254: IC1.2 71.25,14.39 | 71.25,14.39 C11.1 | 71.25,14.39 71.3,14.39 R7.2 74.32,16.93 74.32,18.45 | v30.07,20.45 29.68,20.45 29.48,20.25 28.91,20.25 28.71,20.45 ADC-O3.11 | v42.78,57.19 42.76,57.22 42.33,57.22 42.16,57.05 41.59,57.04 41.42,57.22 ADC-SO2.11 | v99.74,20.48 99.15,20.48 98.96,20.29 98.4,20.29 98.21,20.48 ADC-NO2.11 | ADC-CO.11 84.07,57.16 v84.28,56.95 | v80.86,18.46 v80.86,18.45 74.32,18.45 | 74.32,18.45 74.32,20.16 53.46,20.16 53.46,19.33 35.61,19.33 v35.61,18.88
  Bottom 0.254: v99.74,20.48 99.74,18.45 84.04,18.45 | 84.04,18.45 83.92,18.45 | 84.04,18.45 84.04,18.46 v80.86,18.46 80.86,41.19 80.85,41.19 80.85,42.76 80.86,42.76 80.86,53.07 84.35,53.07 84.35,56.95 v84.28,56.95 82.04,56.95 82.04,59.17 42.78,59.17 v42.78,57.19 | v30.07,20.45 35.61,20.45 v35.61,18.88

### Text on the board
tPlace: ECOBit PV1